# EAGLE schematic Esquemático (EAGLE 9.7.0)
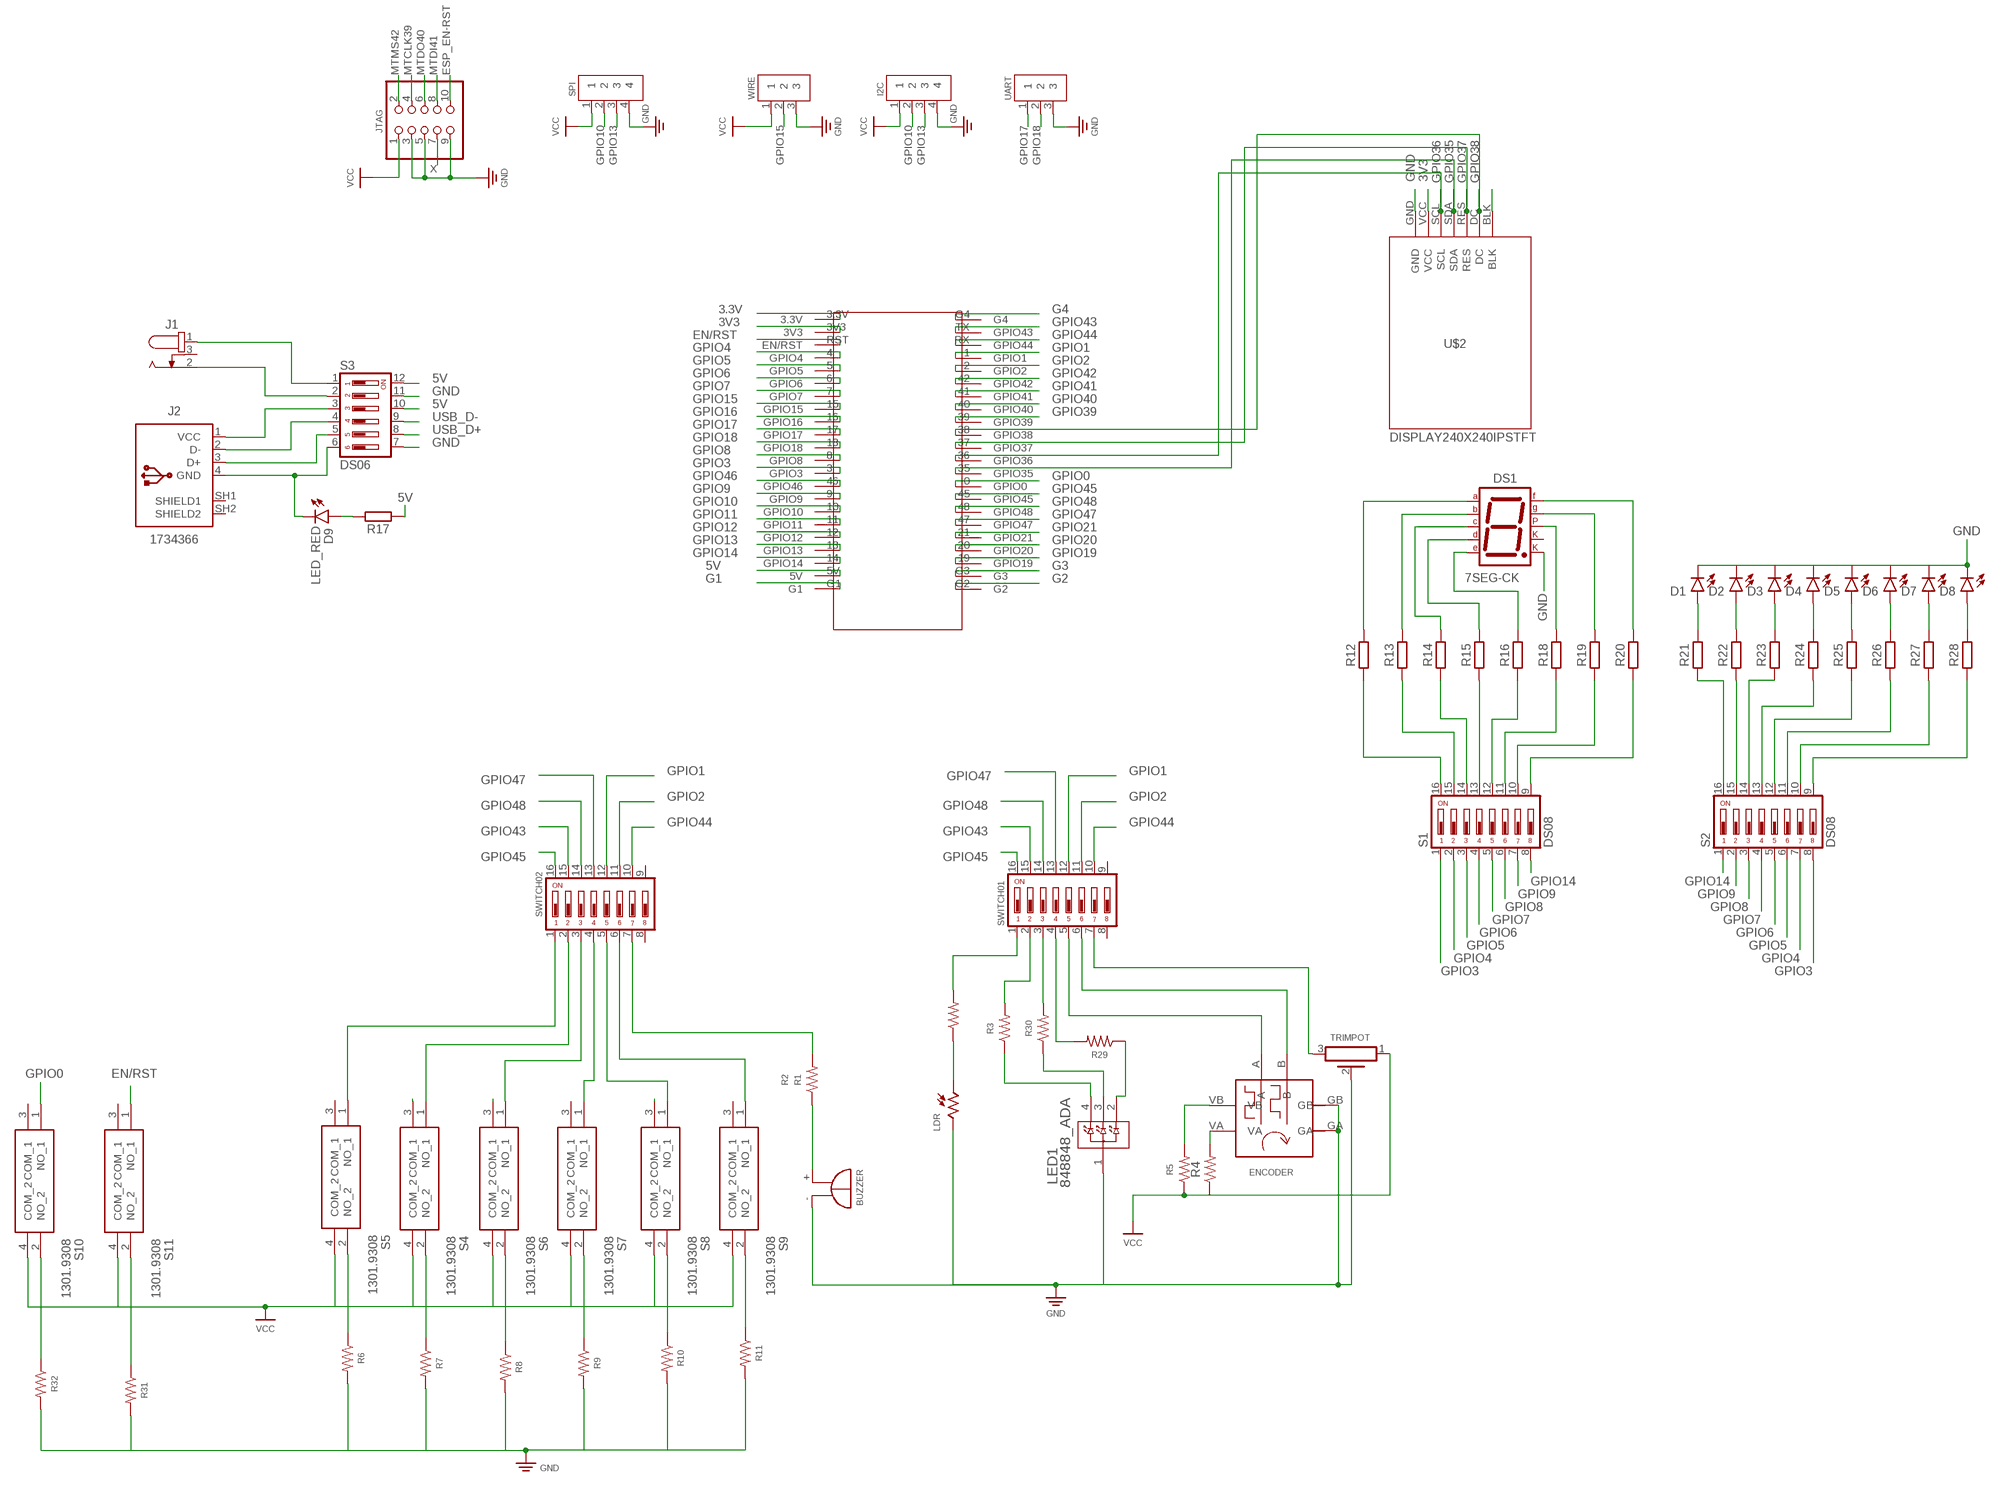
[diagram p0: schematic, sheet 1]

## Parts
BUZZER  F/TMB  [F/TMB]
D1  LED_RADIAL_BLUE  [LEDRD254W60D565H860B_B]
D2  LED_RADIAL_BLUE  [LEDRD254W60D565H860B_B]
D3  LED_RADIAL_BLUE  [LEDRD254W60D565H860B_B]
D4  LED_RADIAL_BLUE  [LEDRD254W60D565H860B_B]
D5  LED_RADIAL_BLUE  [LEDRD254W60D565H860B_B]
D6  LED_RADIAL_BLUE  [LEDRD254W60D565H860B_B]
D7  LED_RADIAL_BLUE  [LEDRD254W60D565H860B_B]
D8  LED_RADIAL_BLUE  [LEDRD254W60D565H860B_B]
D9  LED_RED  LED_RADIAL_RED  [LEDRD254W60D565H860B]
DS1  7SEG-CK  [7SEG-13]
ENCODER  EM11B  [EM11]
I2C  2828XX-4282837-4  [TERMBLK_508-4N]
J1  694106402002  [694106402002]
J2  1734366  [1734366]
JTAG  PINHD-2X5/90  [2X05/90]
LDR  NSL-5510  NSL-5510-TO-5  [NSL-5510]
LED1  848848_ADA  [848_ADA]
R1  R-US_AXIAL-7.2MM-PITCH  [RESAD724W46L381D178B]
R2  R-US_AXIAL-7.2MM-PITCH  [RESAD724W46L381D178B]
R3  R-US_AXIAL-7.2MM-PITCH  [RESAD724W46L381D178B]
R4  R-US_AXIAL-7.2MM-PITCH  [RESAD724W46L381D178B]
R5  R-US_AXIAL-7.2MM-PITCH  [RESAD724W46L381D178B]
R6  R-US_AXIAL-7.2MM-PITCH  [RESAD724W46L381D178B]
R7  R-US_AXIAL-7.2MM-PITCH  [RESAD724W46L381D178B]
R8  R-US_AXIAL-7.2MM-PITCH  [RESAD724W46L381D178B]
R9  R-US_AXIAL-7.2MM-PITCH  [RESAD724W46L381D178B]
R10  R-US_AXIAL-7.2MM-PITCH  [RESAD724W46L381D178B]
R11  R-US_AXIAL-7.2MM-PITCH  [RESAD724W46L381D178B]
R12  R_AXIAL-7.2MM-PITCH  [RESAD724W46L381D178B]
R13  R_AXIAL-7.2MM-PITCH  [RESAD724W46L381D178B]
R14  R_AXIAL-7.2MM-PITCH  [RESAD724W46L381D178B]
R15  R_AXIAL-7.2MM-PITCH  [RESAD724W46L381D178B]
R16  R_AXIAL-7.2MM-PITCH  [RESAD724W46L381D178B]
R17  R_AXIAL-7.2MM-PITCH  [RESAD724W46L381D178B]
R18  R_AXIAL-7.2MM-PITCH  [RESAD724W46L381D178B]
R19  R_AXIAL-7.2MM-PITCH  [RESAD724W46L381D178B]
R20  R_AXIAL-7.2MM-PITCH  [RESAD724W46L381D178B]
R21  R_AXIAL-7.2MM-PITCH  [RESAD724W46L381D178B]
R22  R_AXIAL-7.2MM-PITCH  [RESAD724W46L381D178B]
R23  R_AXIAL-7.2MM-PITCH  [RESAD724W46L381D178B]
R24  R_AXIAL-7.2MM-PITCH  [RESAD724W46L381D178B]
R25  R_AXIAL-7.2MM-PITCH  [RESAD724W46L381D178B]
R26  R_AXIAL-7.2MM-PITCH  [RESAD724W46L381D178B]
R27  R_AXIAL-7.2MM-PITCH  [RESAD724W46L381D178B]
R28  R_AXIAL-7.2MM-PITCH  [RESAD724W46L381D178B]
R29  R-US_AXIAL-7.2MM-PITCH  [RESAD724W46L381D178B]
R30  R-US_AXIAL-7.2MM-PITCH  [RESAD724W46L381D178B]
R31  R-US_AXIAL-7.2MM-PITCH  [RESAD724W46L381D178B]
R32  R-US_AXIAL-7.2MM-PITCH  [RESAD724W46L381D178B]
S1  DS08  [DS-08]
S2  DS08  [DS-08]
S3  DS06  [DS-06]
S4  1301.9308  [13019304]
S5  1301.9308  [13019304]
S6  1301.9308  [13019304]
S7  1301.9308  [13019304]
S8  1301.9308  [13019304]
S9  1301.9308  [13019304]
S10  1301.9308  [13019304]
S11  1301.9308  [13019304]
SPI  2828XX-4282837-4  [TERMBLK_508-4N]
SWITCH01  DS08  [DS-08]
SWITCH02  DS08  [DS-08]
TRIMPOT  PV36Z  [PV36Z]
U$1  ESP32-S3-DEVKITC-1  [ESP32-S3-DEVKITC-1]
U$2  DISPLAY240X240IPSTFT  [TFT]
UART  2828XX-3282837-3  [TERMBLK_508-3N]
WIRE  2828XX-3282837-3  [TERMBLK_508-3N]

## Nets
3.3V: U$1.3.3V
3V3: U$1.3V3 U$2.VCC
5V: R17.1 S3.10 S3.12 U$1.5V
EN/RST: S11.1(NO_1) U$1.RST(EN/RST)
ESP_EN-RST: JTAG.10
G1: U$1.G1
G2: U$1.G2
G3: U$1.G3
G4: U$1.G4
GB: BUZZER.- ENCODER.GA ENCODER.GB LDR.2 LED1.1 TRIMPOT.2 ; supply symbol labelled GND
GND: D1.2(C) D2.2(C) D3.2(C) D4.2(C) D5.2(C) D6.2(C) D7.2(C) D8.2(C) DS1.8(CK2) I2C.4 JTAG.3 JTAG.5 JTAG.9 R6.2 R7.2 R8.2 R9.2 R10.2 R11.2 R31.2 R32.2 S3.7 S3.11 SPI.4 U$2.GND UART.3 WIRE.3
GPIO0: S10.1(NO_1) U$1.0(GPIO0)
GPIO1: SWITCH01.12 SWITCH02.12 U$1.1(GPIO1)
GPIO2: SWITCH01.11 SWITCH02.11 U$1.2(GPIO2)
GPIO3: S1.1 S2.8 U$1.3(GPIO3)
GPIO4: S1.2 S2.7 U$1.4(GPIO4)
GPIO5: S1.3 S2.6 U$1.5(GPIO5)
GPIO6: S1.4 S2.5 U$1.6(GPIO6)
GPIO7: S1.5 S2.4 U$1.7(GPIO7)
GPIO8: S1.6 S2.3 U$1.8(GPIO8)
GPIO9: S1.7 S2.2 U$1.9(GPIO9)
GPIO10: I2C.2 SPI.2 U$1.10(GPIO10)
GPIO11: U$1.11(GPIO11)
GPIO12: U$1.12(GPIO12)
GPIO13: I2C.3 SPI.3 U$1.13(GPIO13)
GPIO14: S1.8 S2.1 U$1.14(GPIO14)
GPIO15: U$1.15(GPIO15) WIRE.2
GPIO16: U$1.16(GPIO16)
GPIO17: U$1.17(GPIO17) UART.1
GPIO18: U$1.18(GPIO18) UART.2
GPIO19: U$1.19(GPIO19)
GPIO20: U$1.20(GPIO20)
GPIO21: U$1.21(GPIO21)
GPIO35: U$1.35(GPIO35) U$2.SDA
GPIO36: U$1.36(GPIO36) U$2.SCL
GPIO37: U$1.37(GPIO37) U$2.RES
GPIO38: U$1.38(GPIO38) U$2.DC
GPIO39: U$1.39(GPIO39)
GPIO40: U$1.40(GPIO40)
GPIO41: U$1.41(GPIO41)
GPIO42: U$1.42(GPIO42)
GPIO43: SWITCH01.15 SWITCH02.15 U$1.TX(GPIO43)
GPIO44: SWITCH01.10 SWITCH02.10 U$1.RX(GPIO44)
GPIO45: SWITCH01.16 SWITCH02.16 U$1.45(GPIO45)
GPIO46: U$1.46(GPIO46)
GPIO47: SWITCH02.13 U$1.47(GPIO47)
GPIO48: SWITCH01.14 SWITCH02.14 U$1.48(GPIO48)
MTCLK39: JTAG.4
MTDI41: JTAG.8
MTDO40: JTAG.6
MTMS42: JTAG.2
N$1: R1.2 SWITCH02.7
N$2: R2.2 SWITCH01.1
N$3: SWITCH01.7 TRIMPOT.3
N$4: S4.3(COM_1)
N$5: S5.1(NO_1) SWITCH02.1
N$6: R30.2 SWITCH01.3
N$7: S4.1(NO_1) SWITCH02.2
N$8: S6.1(NO_1) SWITCH02.3
N$9: S7.1(NO_1) SWITCH02.4
N$10: SWITCH01.13
N$11: S8.1(NO_1) SWITCH02.5
N$12: BUZZER.+ R1.1
N$13: LDR.1 R2.1
N$14: R29.2 SWITCH01.4
N$15: LED1.2 R29.1
N$16: ENCODER.A SWITCH01.5
N$17: ENCODER.B SWITCH01.6
N$18: S9.1(NO_1) SWITCH02.6
N$19: S6.3(COM_1)
N$20: R6.1 S5.2(NO_2)
N$21: R7.1 S4.2(NO_2)
N$22: R8.1 S6.2(NO_2)
N$23: R9.1 S7.2(NO_2)
N$24: R10.1 S8.2(NO_2)
N$25: R11.1 S9.2(NO_2)
N$26: R3.2 SWITCH01.2
N$28: LED1.3 R30.1
N$29: LED1.4 R3.1
N$30: R32.1 S10.2(NO_2)
N$31: J1.1 S3.1
N$32: D1.1(A) R21.2
N$33: D2.1(A) R22.2
N$34: J1.2 S3.2
N$35: J2.1(VCC) S3.3
N$36: D9.2(C) J2.4(GND) S3.6
N$37: J2.2(D-) S3.4
N$38: J2.3(D+) S3.5
N$39: D9.1(A) R17.2
N$40: D3.1(A) R23.2
N$41: D4.1(A) R24.2
N$42: D5.1(A) R25.2
N$43: D6.1(A) R26.2
N$44: D7.1(A) R27.2
N$45: D8.1(A) R28.2
N$46: R21.1 S2.16
N$47: R22.1 S2.15
N$48: R23.1 S2.14
N$49: R28.1 S2.9
N$50: R27.1 S2.10
N$51: R26.1 S2.11
N$52: R25.1 S2.12
N$53: R24.1 S2.13
N$54: DS1.7(A) R12.2
N$55: DS1.6(B) R13.2
N$56: DS1.4(C) R14.2
N$57: DS1.2(D) R15.2
N$58: DS1.1(E) R16.2
N$59: DS1.9(F) R20.2
N$60: DS1.10(G) R19.2
N$61: DS1.5(DP) R18.2
N$62: R13.1 S1.15
N$63: R14.1 S1.14
N$64: R15.1 S1.13
N$65: R16.1 S1.12
N$66: R18.1 S1.11
N$67: R19.1 S1.10
N$68: R20.1 S1.9
N$69: R12.1 S1.16
N$70: S8.3(COM_1)
N$71: R31.1 S11.2(NO_2)
N$76: U$2.BLK
USB_D+: S3.8
USB_D-: S3.9
VA: ENCODER.VA R4.2
VB: ENCODER.VB R5.2
VCC: I2C.1 JTAG.1 R4.1 R5.1 S4.4(COM_2) S5.4(COM_2) S6.4(COM_2) S7.4(COM_2) S8.4(COM_2) S9.4(COM_2) S10.4(COM_2) S11.4(COM_2) SPI.1 TRIMPOT.1 WIRE.1
X: JTAG.7
Unconnected: DS1.3(CK1) J1.3 J2.SH1(SHIELD1) J2.SH2(SHIELD2) S5.3(COM_1) S7.3(COM_1) S9.3(COM_1) S10.3(COM_1) S11.3(COM_1) SWITCH01.8 SWITCH01.9 SWITCH02.8 SWITCH02.9

## Library data of the parts
BUZZER = buzzer:F/TMB: BUZZER Source: Buerklin; OC_FARNELL: unknown; OC_NEWARK: unknown
D1-D8 = Opto-Electronic:LED_RADIAL: LED - Generic; CATEGORY: Opto-Electronic; SUB-CATEGORY: LED; VALUE: LED_BLUE
D9 = Opto-Electronic:LED_RADIAL: LED - Generic; CATEGORY: Opto-Electronic; SUB-CATEGORY: LED
DS1 = Opto-Electronic:7SEG-CK: 7-segment DISPLAY single cathode, 13 mm; CATEGORY: Opto-Electronic; SUB-CATEGORY: Display; TYPE: 7-Segment
ENCODER = rotary-encoder:EM11B: 64-position magnetic rotary encoder (16 detent points)
I2C SPI = Connector:2828XX-4: 4 Position Wire to Board Terminal Block Horizontal with Board Datasheet <https://www.te.com.cn/commerce/DocumentDelivery/DDEController?Action=showdoc&DocId=Catalog+Section%7F1308389_EUROSTYLE_TERMINAL_BLOCKS%7F0607%7Fpdf%7FEnglish%7FENG_CS_1308389_EUROSTYLE_TERMINAL_BLOCKS_0607.pdf%7F2-282837-5>; CATEGORY: Connector; DESCRIPTION: TERM BLK 4P SIDE ENT 5.08mm PCB; MANUFACTURER: TE Connectivity; MPN: 282837-4; OPERATING_TEMPERATURE: 40°C to +105°C; PART_STATUS: Active; ROHS_COMPLIANCE: RoHS Compliant; SERIES: 283737; SUBCATEGORY: Terminal Block; TYPE: Side Wire Entry
J1 = Connector:694106402002: DC POWER JACK - VERTICAL - THT - 2.0 & 2.5Ø - WR-DC Details see: Datasheet <https://katalog.we-online.com/en/em/DC_THT_VERTICAL_6_4_69410X402002>; CATEGORY: Connector; DESCRIPTION: DC POWER JACK - VERTICAL - THT - 2.0 & 2.5Ø - WR-DC; MANUFACTURER: Würth Elektronik; MPN: 694106402002; OPERATING_TEMPERATURE: -40°C to +85°C; PART_STATUS: Active; ROHS_COMPLIANCE: RoHS Compliant; SERIES: WR-DC; SUBCATEGORY: Power Connector; TYPE: Vertical
J2 = Connector_USB:1734366: USB(2.0) Type-A, RCPT, 4POS, THT-VERT Datasheet <https://www.te.com/commerce/DocumentDelivery/DDEController?Action=showdoc&DocId=Data+Sheet%7F7-1773442-0%7F0306%7Fpdf%7FEnglish%7FENG_DS_7-1773442-0_0306.pdf%7F1734366-1> Drawing <https://www.te.com/commerce/DocumentDelivery/DDEController?Action=srchrtrv&DocNm=1734366&DocType=Customer+Drawing&DocLang=English>; CATEGORY: Connector; CONTACTS: 4; CURRENT_RATING: 1A; DESCRIPTION: CONN RCPT USB2.0 TYPEA 4POS VERT; GENDER: Receptacle; MANUFACTURER: TE Connectivity; MOUNT_TYPE: Vertical; MPN: 1734366-1; OPERATING_TEMP: -40° to +80°C; PART_STATUS: Active; ROHS_COMPLIANT: RoHS Compliant; SERIES: -; SUB-CATEGORY: USB; TYPE: USB-A; VOLTAGE_RATING: 30VAC(rms)
JTAG = Connector:PINHD-2X5: PIN HEADER; CATEGORY: CONNECTOR; SUB-CATEGORY: PIN-HEADER
LDR = Sensor:NSL-*-: Hermetic Photocell Datasheet <https://media.digikey.com/pdf/Data%20Sheets/Photonic%20Detetectors%20Inc%20PDFs/NSL-5510.pdf> Datasheet <https://media.digikey.com/pdf/Data%20Sheets/Photonic%20Detetectors%20Inc%20PDFs/Hermetic%20Pkg'd%20CdS%20Product%20Overview.pdf>; CATEGORY: Sensor; DESCRIPTION: The NSL-5510 is a type 5 CdS photoconductive cell in a flat lens TO-5 hermetic package.; MANUFACTURER: API; MPN: NSL-5510; OPERATING_TEMP: -60°C to 75°C; PART_STATUS: Active; ROHS_COMPLIANT: Non-Compliant; SERIES: -; SUB-CATEGORY: Photocell
LED1 = 2022-05-23_13-57-32_Library:848; COPYRIGHT: Copyright (C) 2022 Ultra Librarian. All rights reserved.; MANUFACTURER_PART_NUMBER: 848; MFR_NAME: Adafruit Industries
R1-R11 R29-R32 = Resistor:R-US: Resistor Fixed - ANSI; CATEGORY: Resistor; SUB-CATEGORY: Fixed
R12-R28 = Resistor:R: Resistor Fixed - Generic; CATEGORY: Resistor; SUB-CATEGORY: Fixed
S1 S2 SWITCH01 SWITCH02 = Switch:DS08: DIL/CODE SWITCH; CATEGORY: SWITCH; MPN: MCNDS-08-V; TYPE: SPST
S3 = Switch:DS06: DIL/CODE SWITCH; CATEGORY: SWITCH; MPN: MCNDS-06-V; TYPE: SPST
S4-S11 = 1301.9308:1301.9308: IP40 Black Button Tactile Switch, SPST-NO 3.9mm Source: Datasheet <https://www.schurter.com/en/datasheet/typ_6x6_mm_tact_switches.pdf>; DESCRIPTION: IP40 Black Button Tactile Switch, SPST-NO 3.9mm; HEIGHT: 7.3mm; MANUFACTURER_NAME: SCHURTER; MANUFACTURER_PART_NUMBER: 1301.9308; MOUSER_PART_NUMBER: 693-1301.9308; MOUSER_PRICE-STOCK: https://www.mouser.com/Search/Refine.aspx?Keyword=693-1301.9308
TRIMPOT = Resistor:PV36: Rectangular Trimmer Potentiometers - PV36 Series Datasheet <https://www.bourns.com/docs/Product-Datasheets/pv36.pdf>; CATEGORY: Resistor; DESCRIPTION: Lead Sealed Type Multiturn PV36 Series; MANUFACTURER: BOURNS; MPN: PV36Z; OPERATING_TEMPERATURE: -55 to +125 °C; PART_STATUS: Active; ROHS_COMPLIANCE: RoHS Compliant; SERIES: PV36; SUB-CATEGORY: Trimpot; TYPE: Lead Sealed
U$1 = Microcontrolador:ESP32-S3-DEVKITC-1
U$2 = Display:DISPLAY240X240IPSTFT
UART WIRE = Connector:2828XX-3: 3 Position Wire to Board Terminal Block Horizontal with Board Datasheet <https://www.te.com.cn/commerce/DocumentDelivery/DDEController?Action=showdoc&DocId=Catalog+Section%7F1308389_EUROSTYLE_TERMINAL_BLOCKS%7F0607%7Fpdf%7FEnglish%7FENG_CS_1308389_EUROSTYLE_TERMINAL_BLOCKS_0607.pdf%7F2-282837-5>; CATEGORY: Connector; DESCRIPTION: TERM BLK 3P SIDE ENT 5.08mm PCB; MANUFACTURER: TE Connectivity; MPN: 282837-3; OPERATING_TEMPERATURE: -40°C to +105°C; PART_STATUS: Active; ROHS_COMPLIANCE: RoHS Compliant; SERIES: 282837; SUBCATEGORY: Terminal Block; TYPE: Side Wire Entry